# Altium project PCBLibrary.PrjPcb
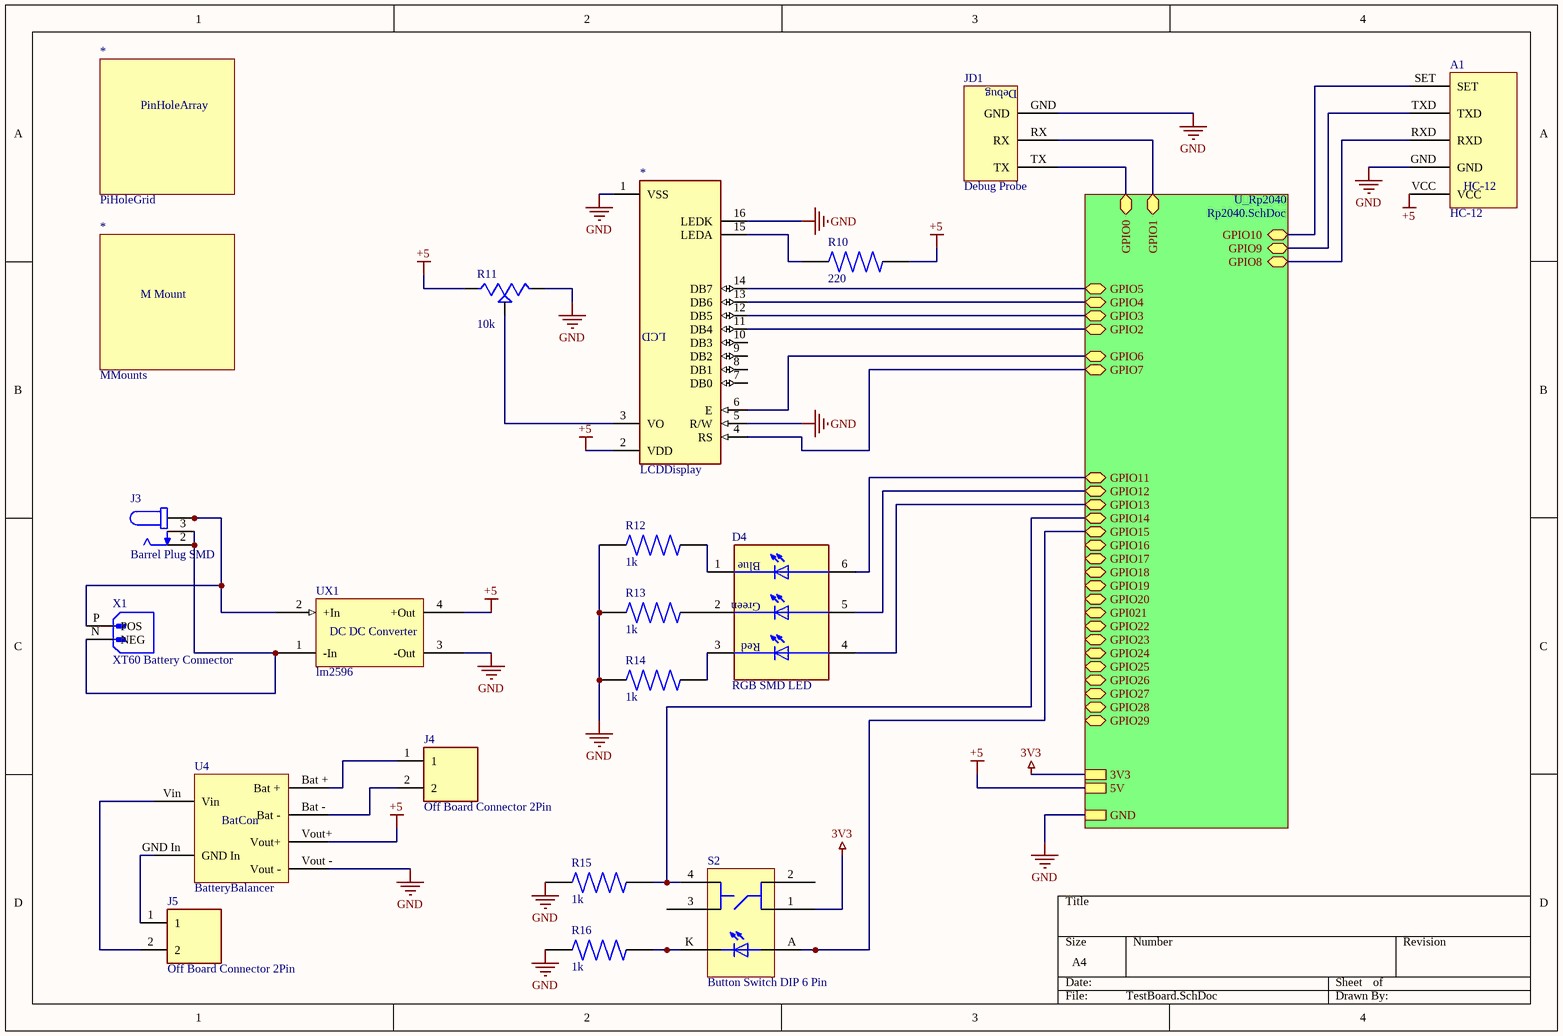
[diagram p0: TestBoard.SchDoc]
6 sheets, 55 parts. Net scope: hierarchical (ports join the sheet entries above them; power ports are global).
Board file: PCB1.PcbDoc
Sheets:
  TestBoard.SchDoc
    U_Rp2040 = Rp2040.SchDoc
      U_USB = USB.SchDoc
      U_Flash = Flash.SchDoc
      U_Crystal = Crystal.SchDoc
      U_Power = Power.SchDoc

## Sheet TestBoard.SchDoc
size A4; SheetNumber: 1; SheetTotal: 6

### Parts
(Parts that share a designator on the sheet are numbered #1, #2 ... from top to bottom, then left to right.)
*#1  PiHoleGrid  [PinHoleGrid]
*#2  LCDDisplay  [LCDDisplay]
*#3  MMounts  [M Mount]
A1  HC-12  [HC-12]
D4  RGB SMD LED  [SMD RGB LED]
J3  Barrel Plug SMD  [Barrel Plug SMD]
J4  Off Board Connector 2Pin  [OFF BORAD CONNECTOR 2PIN]
J5  Off Board Connector 2Pin  [OFF BORAD CONNECTOR 2PIN]
JD1  Debug Probe  [DebugProbe]
R10  220  [Resistor]
R11  10k  [Poti 3296]
R12  1k  [SMD Resistor]
R13  1k  [SMD Resistor]
R14  1k  [SMD Resistor]
R15  1k  [Resistor]
R16  1k  [Resistor]
S2  Button Switch DIP 6 Pin  [Button Switch DIP 6 Pin]
U4  BatteryBalancer  [BatteryBalancer]
UX1  lm2596  [LM2596]
X1  XT60 Battery Connector  [XT60 Battery Connector]

### Sub-sheets
U_Rp2040 = Rp2040.SchDoc: GPIO0 (bidir), GPIO1 (bidir), GPIO2 (bidir), GPIO3 (bidir), GPIO4 (bidir), GPIO5 (bidir), GPIO6 (bidir), GPIO7 (bidir), GPIO8 (bidir), GPIO9 (bidir), GPIO10 (bidir), GPIO11 (bidir), GPIO12 (bidir), GPIO13 (bidir), GPIO14 (bidir), GPIO15 (bidir), GPIO16 (bidir), GPIO17 (bidir), GPIO18 (bidir), GPIO19 (bidir), GPIO20 (bidir), GPI021 (bidir), GPIO22 (bidir), GPIO23 (bidir), GPIO24 (bidir), GPIO25 (bidir), GPIO26 (bidir), GPIO27 (bidir), GPIO28 (bidir), GPIO29 (bidir), 3V3, 5V, GND

### Nets
3V3: S2.1 ; sheet U_Rp2040/3V3
+5: *#2.2(VDD) A1.VCC R10.2 R11.1(CCW) U4.Vout+ UX1.4(+Out) ; sheet U_Rp2040/5V
GND: *#2.1(VSS) *#2.5(R/W) *#2.16(LEDK) A1.GND JD1.GND R11.3(CW) R12.1 R13.1 R14.1 R15.1 R16.1 U4.Vout_- UX1.3(-Out) ; sheet U_Rp2040/GND
Net*#2_3: *#2.3(VO) R11.2(WIPER)
Net*#2_4: *#2.4(RS) ; sheet U_Rp2040/GPIO7
Net*#2_6: *#2.6(E) ; sheet U_Rp2040/GPIO6
Net*#2_11: *#2.11(DB4) ; sheet U_Rp2040/GPIO2
Net*#2_12: *#2.12(DB5) ; sheet U_Rp2040/GPIO3
Net*#2_13: *#2.13(DB6) ; sheet U_Rp2040/GPIO4
Net*#2_14: *#2.14(DB7) ; sheet U_Rp2040/GPIO5
Net*#2_15: *#2.15(LEDA) R10.1
NetA1_RXD: A1.RXD ; sheet U_Rp2040/GPIO8
NetA1_SET: A1.SET ; sheet U_Rp2040/GPIO10
NetA1_TXD: A1.TXD ; sheet U_Rp2040/GPIO9
NetD4_1: D4.1 R12.2
NetD4_2: D4.2 R13.2
NetD4_3: D4.3 R14.2
NetD4_4: D4.4 ; sheet U_Rp2040/GPIO13
NetD4_5: D4.5 ; sheet U_Rp2040/GPIO12
NetD4_6: D4.6 ; sheet U_Rp2040/GPIO11
NetJ3_1A: J3.1A J3.1B UX1.2(+In) X1.P(POS)
NetJ3_2: J3.2 J3.3 UX1.1(-In) X1.N(NEG)
NetJ4_1: J4.1 U4.Bat_+
NetJ4_2: J4.2 U4.Bat_-
NetJ5_1: J5.1 U4.GND_In
NetJ5_2: J5.2 U4.Vin
NetJD1_RX: JD1.RX ; sheet U_Rp2040/GPIO1
NetJD1_TX: JD1.TX ; sheet U_Rp2040/GPIO0
NetR15_2: R15.2 S2.4 ; sheet U_Rp2040/GPIO14
NetR16_2: R16.2 S2.K
NetS2_A: S2.A ; sheet U_Rp2040/GPIO15

Not connected (* = marked no-connect by the designer): *#2 7(DB0) 8(DB1) 9(DB2) 10(DB3); S2 2 3

### Notes on the sheet
- (in symbol BatteryBalancer) BatCon
- (in symbol Debug Probe) Debug
- (in symbol LCDDisplay) LCD
- (in symbol lm2596) DC DC Converter
- (in symbol MMounts) M Mount
- (in symbol PiHoleGrid) PinHoleArray
- (in symbol RGB SMD LED) Blue; Green; Red

### Library data of the parts
J4 J5 = Off Board Connector 2Pin: Screw Connector
R10 R15 R16 = Resistor
R11 = Poti 3296
R12-R14 = SMD Resistor

## Sheet Rp2040.SchDoc
size A4; SheetNumber: 2; SheetTotal: 6
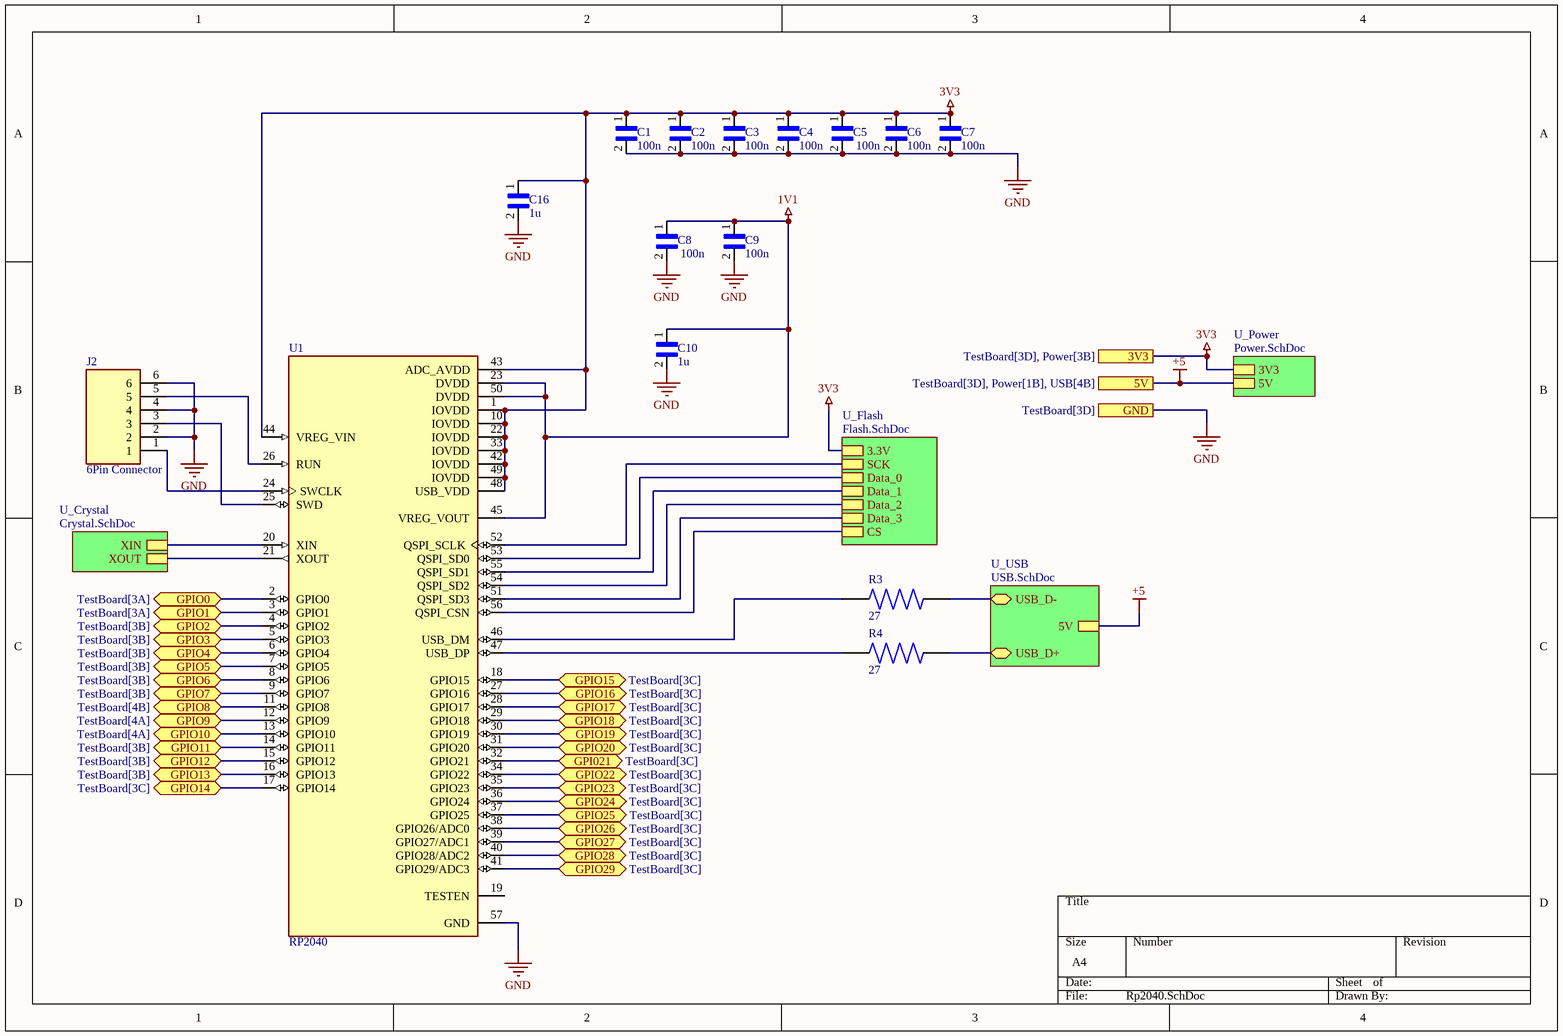
[diagram p1: Rp2040.SchDoc]

### Parts
C1  100n  [SMD Capacator]
C2  100n  [SMD Capacator]
C3  100n  [SMD Capacator]
C4  100n  [SMD Capacator]
C5  100n  [SMD Capacator]
C6  100n  [SMD Capacator]
C7  100n  [SMD Capacator]
C8  100n  [SMD Capacator]
C9  100n  [SMD Capacator]
C10  1u  [SMD Capacator]
C16  1u  [SMD Capacator]
J2  6Pin Connector  [6Pin Connector]
R3  27  [SMD Resistor]
R4  27  [SMD Resistor]
U1  RP2040  [RP2040]

### Sub-sheets
U_Crystal = Crystal.SchDoc: XIN, XOUT
U_Flash = Flash.SchDoc: 3.3V, SCK, Data_0, Data_1, Data_2, Data_3, CS
U_Power = Power.SchDoc: 5V, 3V3
U_USB = USB.SchDoc: 5V, USB_D+ (bidir), USB_D- (bidir)

### Ports
3V3 (see TestBoard[3D], Power[3B]), 5V (see TestBoard[3D], Power[1B], USB[4B]), GND (see TestBoard[3D]), GPI021 (bidir, see TestBoard[3C]), GPIO0 (bidir, see TestBoard[3A]), GPIO1 (bidir, see TestBoard[3A]), GPIO2 (bidir, see TestBoard[3B]), GPIO3 (bidir, see TestBoard[3B]), GPIO4 (bidir, see TestBoard[3B]), GPIO5 (bidir, see TestBoard[3B]), GPIO6 (bidir, see TestBoard[3B]), GPIO7 (bidir, see TestBoard[3B]), GPIO8 (bidir, see TestBoard[4B]), GPIO9 (bidir, see TestBoard[4A]), GPIO10 (bidir, see TestBoard[4A]), GPIO11 (bidir, see TestBoard[3B]), GPIO12 (bidir, see TestBoard[3B]), GPIO13 (bidir, see TestBoard[3B]), GPIO14 (bidir, see TestBoard[3C]), GPIO15 (bidir, see TestBoard[3C]), GPIO16 (bidir, see TestBoard[3C]), GPIO17 (bidir, see TestBoard[3C]), GPIO18 (bidir, see TestBoard[3C]), GPIO19 (bidir, see TestBoard[3C]), GPIO20 (bidir, see TestBoard[3C]), GPIO22 (bidir, see TestBoard[3C]), GPIO23 (bidir, see TestBoard[3C]), GPIO24 (bidir, see TestBoard[3C]), GPIO25 (bidir, see TestBoard[3C]), GPIO26 (bidir, see TestBoard[3C]), GPIO27 (bidir, see TestBoard[3C]), GPIO28 (bidir, see TestBoard[3C]), GPIO29 (bidir, see TestBoard[3C])

### Nets
1V1: C8.1 C9.1 C10.1 U1.23(DVDD) U1.45(VREG_VOUT) U1.50(DVDD)
3V3: C1.1 C2.1 C3.1 C4.1 C5.1 C6.1 C7.1 C16.1 U1.1(IOVDD) U1.10(IOVDD) U1.22(IOVDD) U1.33(IOVDD) U1.42(IOVDD) U1.43(ADC_AVDD) U1.44(VREG_VIN) U1.48(USB_VDD) U1.49(IOVDD) ; port 3V3, sheet U_Flash/3.3V, sheet U_Power/3V3
+5: port 5V, sheet U_USB/5V, sheet U_Power/5V
GND: C1.2 C2.2 C3.2 C4.2 C5.2 C6.2 C7.2 C8.2 C9.2 C10.2 C16.2 J2.2 J2.4 J2.6 U1.57(GND) ; port GND
Net*#2_4: U1.9(GPIO7) ; port GPIO7
Net*#2_6: U1.8(GPIO6) ; port GPIO6
Net*#2_11: U1.4(GPIO2) ; port GPIO2
Net*#2_12: U1.5(GPIO3) ; port GPIO3
Net*#2_13: U1.6(GPIO4) ; port GPIO4
Net*#2_14: U1.7(GPIO5) ; port GPIO5
NetA1_RXD: U1.11(GPIO8) ; port GPIO8
NetA1_SET: U1.13(GPIO10) ; port GPIO10
NetA1_TXD: U1.12(GPIO9) ; port GPIO9
NetC12_2: U1.20(XIN) ; sheet U_Crystal/XIN
NetD4_4: U1.16(GPIO13) ; port GPIO13
NetD4_5: U1.15(GPIO12) ; port GPIO12
NetD4_6: U1.14(GPIO11) ; port GPIO11
NetJ1_A6: R4.2 ; sheet U_USB/USB_D+
NetJ1_A7: R3.2 ; sheet U_USB/USB_D-
NetJ2_1: J2.1 U1.24(SWCLK)
NetJ2_3: J2.3 U1.25(SWD)
NetJ2_5: J2.5 U1.26(RUN)
NetJD1_RX: U1.3(GPIO1) ; port GPIO1
NetJD1_TX: U1.2(GPIO0) ; port GPIO0
NetR3_1: R3.1 U1.46(USB_DM)
NetR4_1: R4.1 U1.47(USB_DP)
NetR5_1: U1.56(QSPI_CSN) ; sheet U_Flash/CS
NetR7_2: U1.21(XOUT) ; sheet U_Crystal/XOUT
NetR15_2: U1.17(GPIO14) ; port GPIO14
NetS2_A: U1.18(GPIO15) ; port GPIO15
NetU1_27: U1.27(GPIO16) ; port GPIO16
NetU1_28: U1.28(GPIO17) ; port GPIO17
NetU1_29: U1.29(GPIO18) ; port GPIO18
NetU1_30: U1.30(GPIO19) ; port GPIO19
NetU1_31: U1.31(GPIO20) ; port GPIO20
NetU1_32: U1.32(GPIO21) ; port GPI021
NetU1_34: U1.34(GPIO22) ; port GPIO22
NetU1_35: U1.35(GPIO23) ; port GPIO23
NetU1_36: U1.36(GPIO24) ; port GPIO24
NetU1_37: U1.37(GPIO25) ; port GPIO25
NetU1_38: U1.38(GPIO26/ADC0) ; port GPIO26
NetU1_39: U1.39(GPIO27/ADC1) ; port GPIO27
NetU1_40: U1.40(GPIO28/ADC2) ; port GPIO28
NetU1_41: U1.41(GPIO29/ADC3) ; port GPIO29
NetU1_51: U1.51(QSPI_SD3) ; sheet U_Flash/Data_3
NetU1_52: U1.52(QSPI_SCLK) ; sheet U_Flash/SCK
NetU1_53: U1.53(QSPI_SD0) ; sheet U_Flash/Data_0
NetU1_54: U1.54(QSPI_SD2) ; sheet U_Flash/Data_2
NetU1_55: U1.55(QSPI_SD1) ; sheet U_Flash/Data_1

Not connected (* = marked no-connect by the designer): U1 19(TESTEN)

### Library data of the parts
C1-C10 C16 = SMD Capacator
R3 R4 = SMD Resistor

## Sheet USB.SchDoc
size A4; SheetNumber: 3; SheetTotal: 6
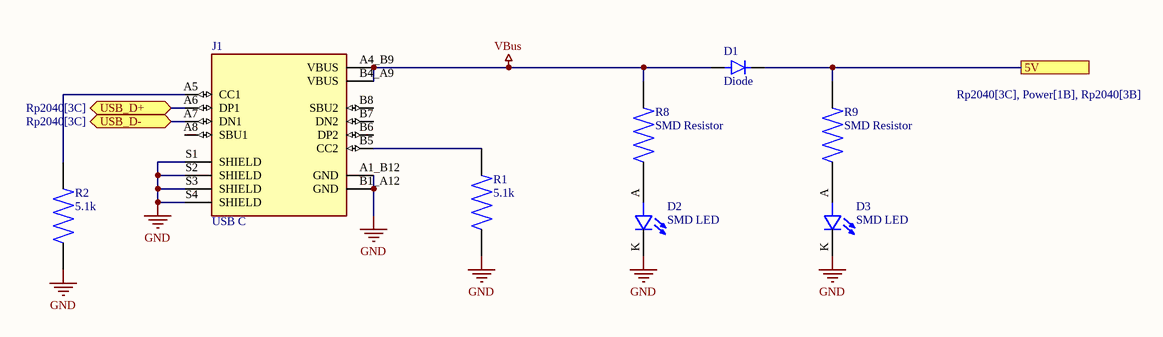
[diagram p2: USB.SchDoc]

### Parts
D1  Diode  [Diode]
D2  SMD LED  [SMD LED]
D3  SMD LED  [SMD LED]
J1  USB C  [USB C]
R1  5.1k  [SMD Resistor]
R2  5.1k  [SMD Resistor]
R8  SMD Resistor  [SMD Resistor]
R9  SMD Resistor  [SMD Resistor]

### Ports
5V (see Rp2040[3C], Power[1B], Rp2040[3B]), USB_D+ (bidir, see Rp2040[3C]), USB_D- (bidir, see Rp2040[3C])

### Nets
+5: D1.K R9.1 ; port 5V
GND: D2.K(C) D3.K(C) J1.A1_B12(GND) J1.B1_A12(GND) J1.S1(SHIELD) J1.S2(SHIELD) J1.S3(SHIELD) J1.S4(SHIELD) R1.2 R2.2
VBus: D1.A J1.A4_B9(VBUS) J1.B4_A9(VBUS) R8.1
NetD2_A: D2.A R8.2
NetD3_A: D3.A R9.2
NetJ1_A5: J1.A5(CC1) R2.1
NetJ1_A6: J1.A6(DP1) ; port USB_D+
NetJ1_A7: J1.A7(DN1) ; port USB_D-
NetJ1_B5: J1.B5(CC2) R1.1

Not connected (* = marked no-connect by the designer): J1 A8(SBU1) B6(DP2) B7(DN2) B8(SBU2)

### Library data of the parts
R1 R2 = SMD Resistor

## Sheet Flash.SchDoc
size A4; SheetNumber: 4; SheetTotal: 6
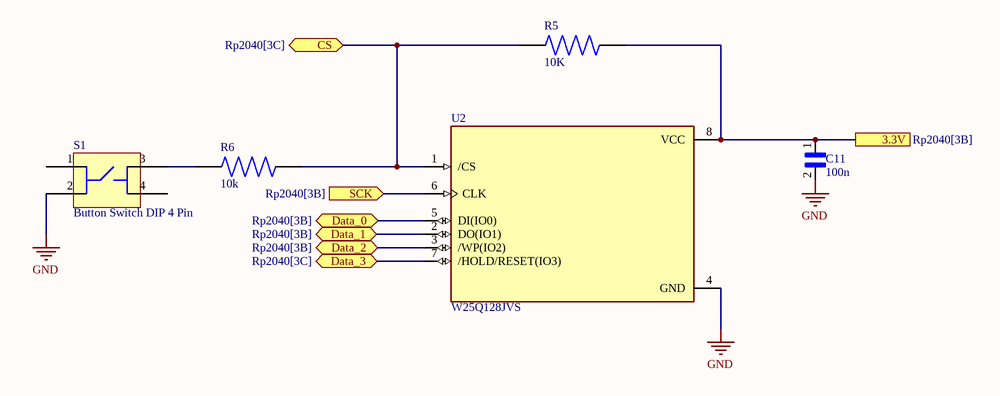
[diagram p3: Flash.SchDoc]

### Parts
C11  100n  [SMD Capacator]
R5  10K  [SMD Resistor]
R6  10k  [SMD Resistor]
S1  Button Switch DIP 4 Pin  [Button Switch DIP 4 Pin]
U2  W25Q128JVS  [W25Q128JVS]

### Ports
3.3V (see Rp2040[3B]), CS (bidir, see Rp2040[3C]), Data_0 (bidir, see Rp2040[3B]), Data_1 (bidir, see Rp2040[3B]), Data_2 (bidir, see Rp2040[3B]), Data_3 (bidir, see Rp2040[3C]), SCK (in, see Rp2040[3B])

### Nets
3V3: C11.1 R5.2 U2.8(VCC) ; port 3.3V
GND: C11.2 S1.2 U2.4(GND)
NetR5_1: R5.1 R6.2 U2.1(/CS) ; port CS
NetR6_1: R6.1 S1.3
NetU1_51: U2.7(/HOLD/RESET(IO3)) ; port Data_3
NetU1_52: U2.6(CLK) ; port SCK
NetU1_53: U2.5(DI(IO0)) ; port Data_0
NetU1_54: U2.3(/WP(IO2)) ; port Data_2
NetU1_55: U2.2(DO(IO1)) ; port Data_1

Not connected (* = marked no-connect by the designer): S1 1 4

### Library data of the parts
C11 = SMD Capacator
R5 R6 = SMD Resistor

## Sheet Crystal.SchDoc
size A4; SheetNumber: 5; SheetTotal: 6
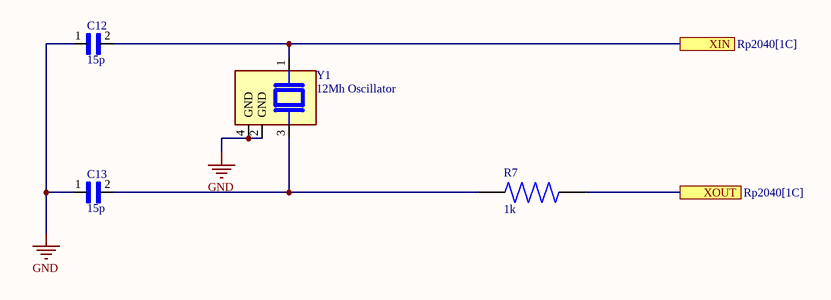
[diagram p4: Crystal.SchDoc]

### Parts
C12  15p  [SMD Capacator]
C13  15p  [SMD Capacator]
R7  1k  [SMD Resistor]
Y1  12Mh Oscillator  [12Mh Oscillator]

### Ports
XIN (see Rp2040[1C]), XOUT (see Rp2040[1C])

### Nets
GND: C12.1 C13.1 Y1.2(GND) Y1.4(GND)
NetC12_2: C12.2 Y1.1 ; port XIN
NetC13_2: C13.2 R7.1 Y1.3
NetR7_2: R7.2 ; port XOUT

### Library data of the parts
C12 C13 = SMD Capacator
R7 = SMD Resistor

## Sheet Power.SchDoc
size A4; SheetNumber: 6; SheetTotal: 6
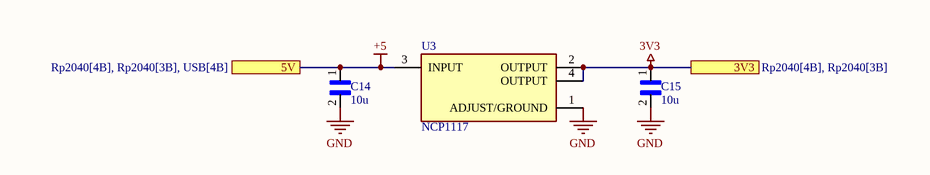
[diagram p5: Power.SchDoc]

### Parts
C14  10u  [SMD Capacator]
C15  10u  [SMD Capacator]
U3  NCP1117  [NCP1117]

### Ports
3V3 (see Rp2040[4B], Rp2040[3B]), 5V (see Rp2040[4B], Rp2040[3B], USB[4B])

### Nets
3V3: C15.1 U3.2(OUTPUT) U3.4(OUTPUT) ; port 3V3
+5: C14.1 U3.3(INPUT) ; port 5V
GND: C14.2 C15.2 U3.1(ADJUST/GROUND)

### Library data of the parts
C14 C15 = SMD Capacator

## Nets that join several sheets
3V3: TestBoard (S2.1), Rp2040 (17 pins), Flash (C11.1 R5.2 U2.8), Power (C15.1 U3.2 U3.4)
+5: TestBoard (6 pins), USB (D1.K R9.1), Power (C14.1 U3.3)
GND: TestBoard (13 pins), Rp2040 (15 pins), USB (10 pins), Flash (C11.2 S1.2 U2.4), Crystal (C12.1 C13.1 Y1.2 Y1.4), Power (C14.2 C15.2 U3.1)
Net*#2_4: TestBoard (*#2.4), Rp2040 (U1.9)
Net*#2_6: TestBoard (*#2.6), Rp2040 (U1.8)
Net*#2_11: TestBoard (*#2.11), Rp2040 (U1.4)
Net*#2_12: TestBoard (*#2.12), Rp2040 (U1.5)
Net*#2_13: TestBoard (*#2.13), Rp2040 (U1.6)
Net*#2_14: TestBoard (*#2.14), Rp2040 (U1.7)
NetA1_RXD: TestBoard (A1.RXD), Rp2040 (U1.11)
NetA1_SET: TestBoard (A1.SET), Rp2040 (U1.13)
NetA1_TXD: TestBoard (A1.TXD), Rp2040 (U1.12)
NetC12_2: Rp2040 (U1.20), Crystal (C12.2 Y1.1)
NetD4_4: TestBoard (D4.4), Rp2040 (U1.16)
NetD4_5: TestBoard (D4.5), Rp2040 (U1.15)
NetD4_6: TestBoard (D4.6), Rp2040 (U1.14)
NetJ1_A6: Rp2040 (R4.2), USB (J1.A6)
NetJ1_A7: Rp2040 (R3.2), USB (J1.A7)
NetJD1_RX: TestBoard (JD1.RX), Rp2040 (U1.3)
NetJD1_TX: TestBoard (JD1.TX), Rp2040 (U1.2)
NetR5_1: Rp2040 (U1.56), Flash (R5.1 R6.2 U2.1)
NetR7_2: Rp2040 (U1.21), Crystal (R7.2)
NetR15_2: TestBoard (R15.2 S2.4), Rp2040 (U1.17)
NetS2_A: TestBoard (S2.A), Rp2040 (U1.18)
NetU1_51: Rp2040 (U1.51), Flash (U2.7)
NetU1_52: Rp2040 (U1.52), Flash (U2.6)
NetU1_53: Rp2040 (U1.53), Flash (U2.5)
NetU1_54: Rp2040 (U1.54), Flash (U2.3)
NetU1_55: Rp2040 (U1.55), Flash (U2.2)